# Altium schematic sheet 主板_1.SchDoc
size A4; SheetNumber: 1; SheetTotal: 3
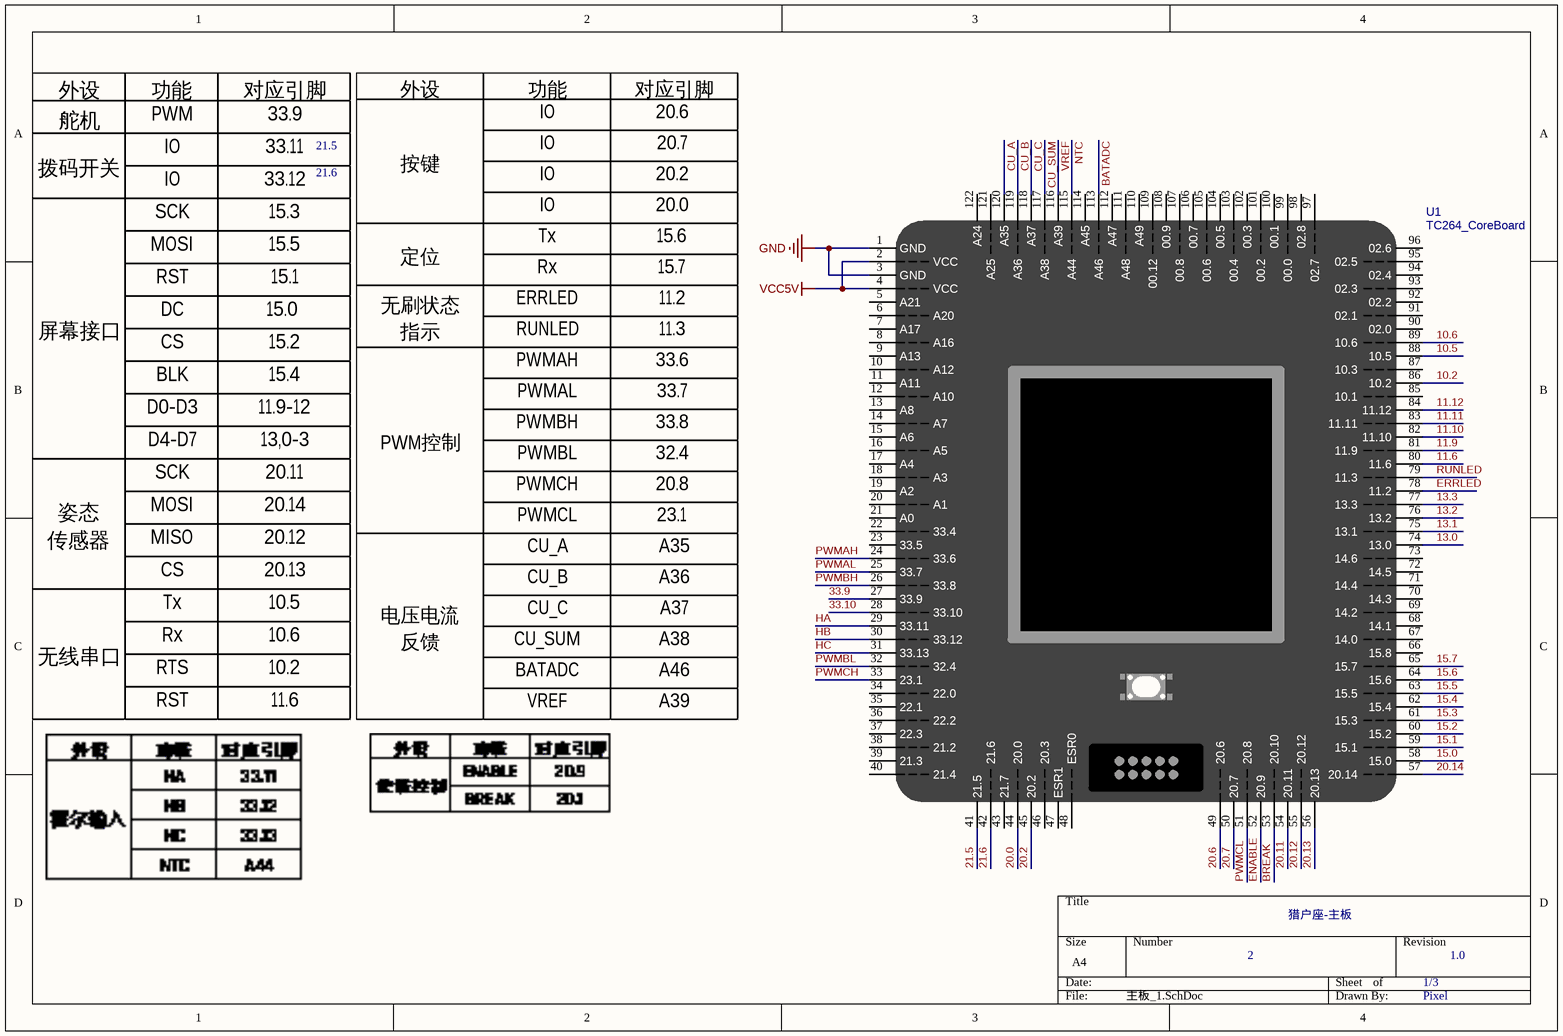
[diagram p0: 主板_1.SchDoc]

## Parts
U1  TC264_CoreBoard  [TC264_CoreBoard]

## Nets
GND: U1.1(GND) U1.3(GND)
VCC5V: U1.2(VCC) U1.4(VCC)
10.2: U1.86(10.2)
10.5: U1.88(10.5)
10.6: U1.89(10.6)
11.6: U1.80(11.6)
11.9: U1.81(11.9)
11.10: U1.82(11.10)
11.11: U1.83(11.11)
11.12: U1.84(11.12)
13.0: U1.74(13.0)
13.1: U1.75(13.1)
13.2: U1.76(13.2)
13.3: U1.77(13.3)
15.0: U1.58(15.0)
15.1: U1.59(15.1)
15.2: U1.60(15.2)
15.3: U1.61(15.3)
15.4: U1.62(15.4)
15.5: U1.63(15.5)
15.6: U1.64(15.6)
15.7: U1.65(15.7)
20.0: U1.44(20.0)
20.2: U1.45(20.2)
20.6: U1.49(20.6)
20.7: U1.50(20.7)
20.11: U1.54(20.11)
20.12: U1.55(20.12)
20.13: U1.56(20.13)
20.14: U1.57(20.14)
21.5: U1.41(21.5)
21.6: U1.42(21.6)
33.9: U1.27(33.9)
33.10: U1.28(33.10)
BATADC: U1.113(A46)
BREAK: U1.53(20.10)
CU_A: U1.120(A35)
CU_B: U1.119(A36)
CU_C: U1.118(A37)
CU_SUM: U1.117(A38)
ENABLE: U1.52(20.9)
ERRLED: U1.78(11.2)
HA: U1.29(33.11)
HB: U1.30(33.12)
HC: U1.31(33.13)
NTC: U1.115(A44)
PWMAH: U1.24(33.6)
PWMAL: U1.25(33.7)
PWMBH: U1.26(33.8)
PWMBL: U1.32(32.4)
PWMCH: U1.33(23.1)
PWMCL: U1.51(20.8)
RUNLED: U1.79(11.3)
VREF: U1.116(A39)

Not connected (* = marked no-connect by the designer): U1 5(A21) 6(A20) 7(A17) 8(A16) 9(A13) 10(A12) 11(A11) 12(A10) 13(A8) 14(A7) 15(A6) 16(A5) 17(A4) 18(A3) 19(A2) 20(A1) 21(A0) 22(33.4) 23(33.5) 34(22.0) 35(22.1) 36(22.2) 37(22.3) 38(21.2) 39(21.3) 40(21.4) 43(21.7) 46(20.3) 47(ESR1) 48(ESR0) 66(15.8) 67(14.0) 68(14.1) 69(14.2) 70(14.3) 71(14.4) 72(14.5) 73(14.6) 85(10.1) 87(10.3) 90(02.0) 91(02.1) 92(02.2) 93(02.3) 94(02.4) 95(02.5) 96(02.6) 97(02.7) 98(02.8) 99(00.0) 100(00.1) 101(00.2) 102(00.3) 103(00.4) 104(00.5) 105(00.6) 106(00.7) 107(00.8) 108(00.9) 109(00.12) 110(A49) 111(A48) 112(A47) 114(A45) 121(A25) 122(A24)

## Notes on the sheet
- 21.5
- 21.6
- 猎户座-主板
- 2
- 1/3
- 1.0
- Pixel

## Library data of the parts
U1 = TC264_CoreBoard: 逐飞科技TC264核心板